# EAGLE design 3DR-GPS-LEA6-JST-v11-RELEASE (EAGLE 6.2)
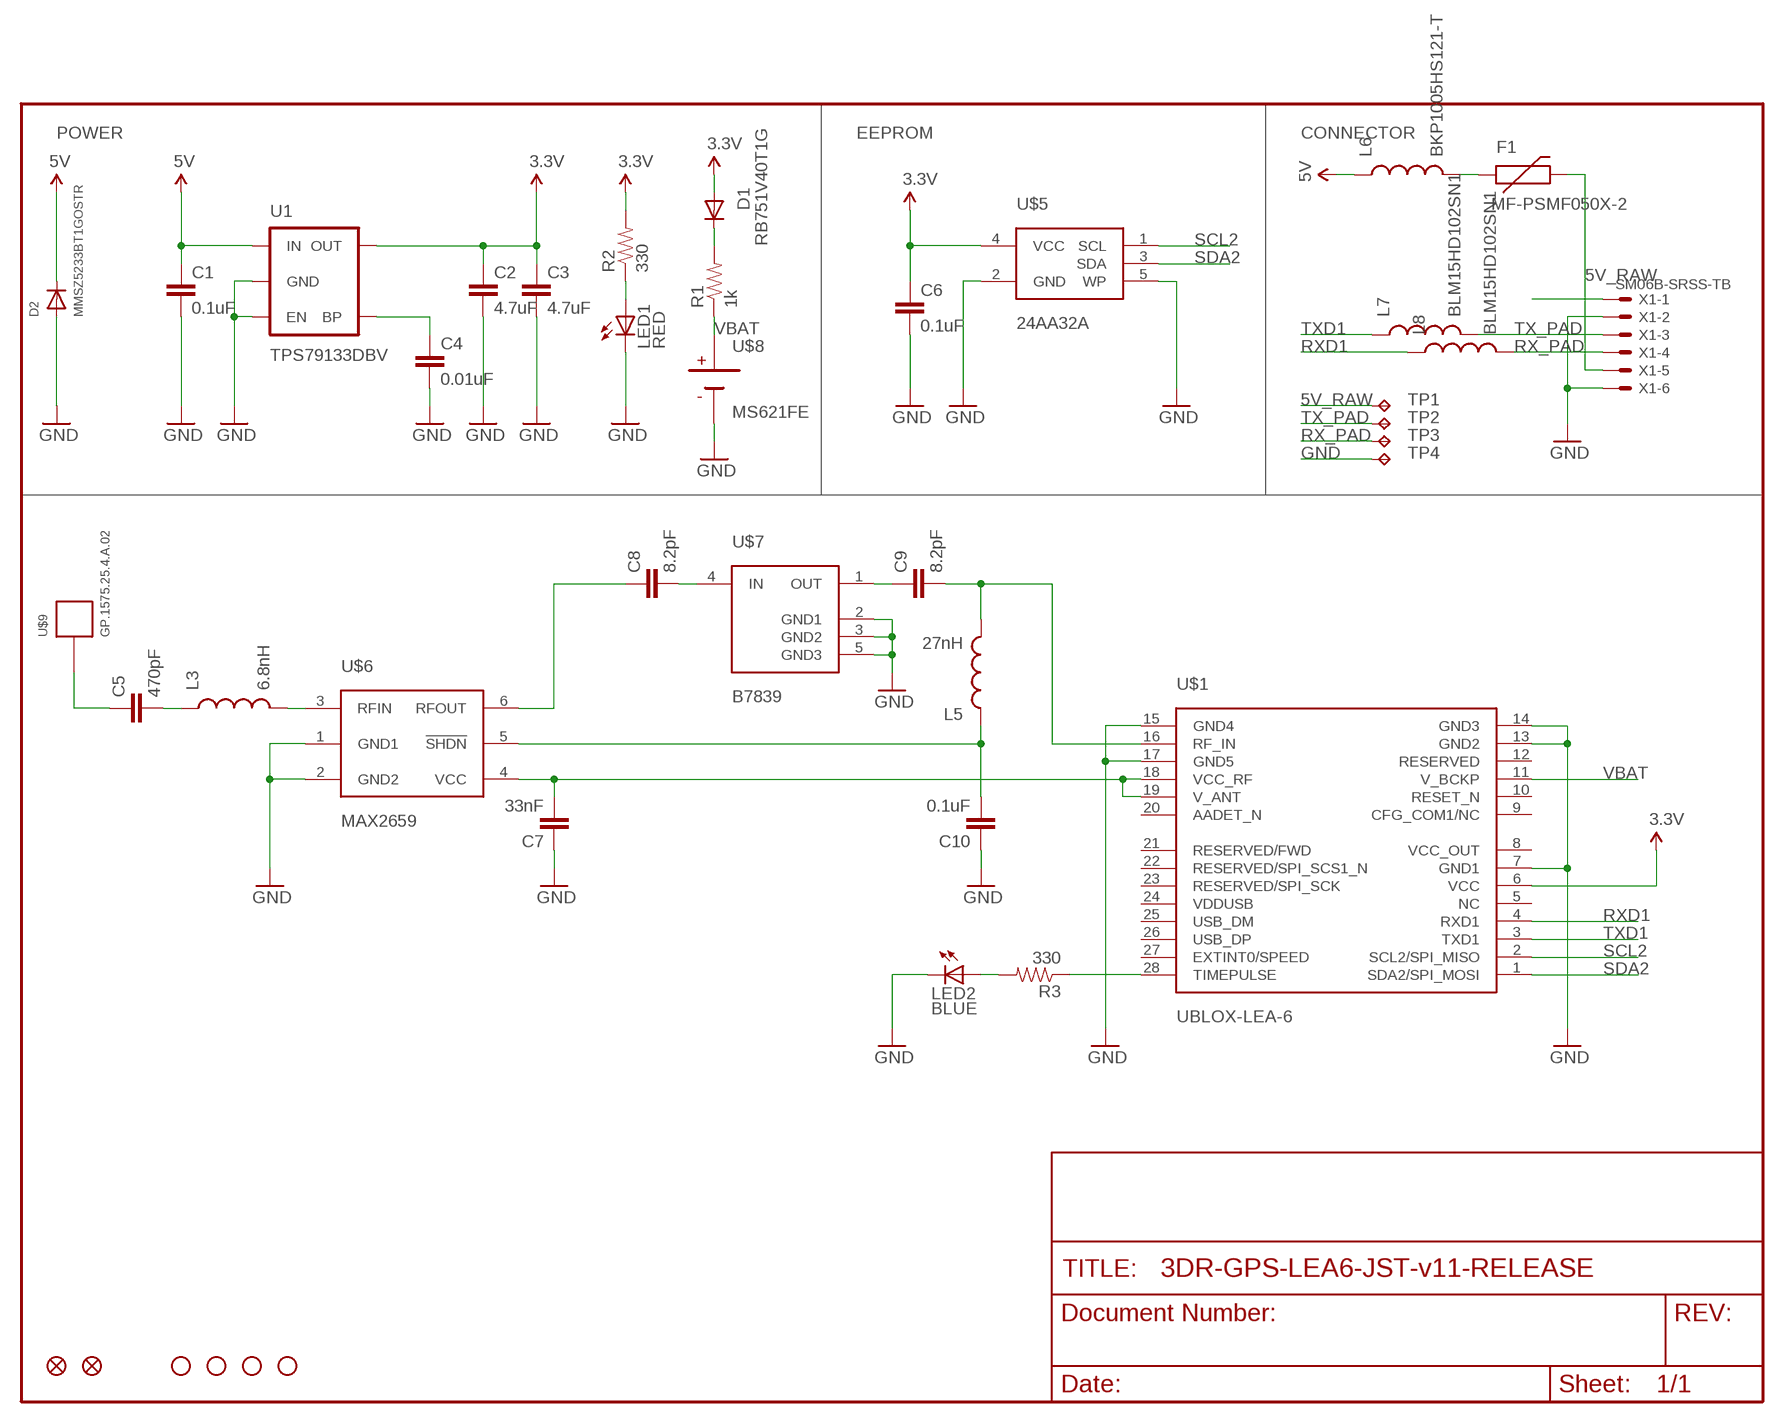
[diagram p0: schematic, sheet 1]

## Parts
C1  0.1uF  CAP0402-CAP  [0402-CAP]
C2  4.7uF  CAP0805  [0805]
C3  4.7uF  CAP0805  [0805]
C4  0.01uF  CAP0402-CAP  [0402-CAP]
C5  470pF  CAP0402-CAP  [0402-CAP]
C6  0.1uF  CAP0402-CAP  [0402-CAP]
C7  33nF  CAP0402-CAP  [0402-CAP]
C8  8.2pF  CAP0402-CAP  [0402-CAP]
C9  8.2pF  CAP0402-CAP  [0402-CAP]
C10  0.1uF  CAP0402-CAP  [0402-CAP]
D1  RB751V40T1G  DIODESOD  [SOD-323]
D2  MMSZ5233BT1GOSTR  DIODESOD-123  [SOD-123]
F1  MF-PSMF050X-2  PTC  [0805]
JP1  FIDUCIAL1X2  [FIDUCIAL-1X2]
JP2  FIDUCIAL1X2  [FIDUCIAL-1X2]
JP3  STAND-OFF  [STAND-OFF]
JP4  STAND-OFF  [STAND-OFF]
JP5  STAND-OFF  [STAND-OFF]
JP6  STAND-OFF  [STAND-OFF]
L3  6.8nH  INDUCTOR0402  [C0402]
L5  27nH  INDUCTOR0402  [C0402]
L6  BKP1005HS121-T  INDUCTOR0402  [0402-IND]
L7  BLM15HD102SN1  INDUCTOR0402  [0402-IND]
L8  BLM15HD102SN1  INDUCTOR0402  [0402-IND]
LED1  RED  LED0603  [LED-0603]
LED2  BLUE  LED0603  [LED-0603]
R1  1k  RESISTOR0402-RES  [0402-RES]
R2  330  RESISTOR0402-RES  [0402-RES]
R3  330  RESISTOR0402-RES  [0402-RES]
TP1  TPTP20SQ  [TP20SQ]
TP2  TPTP20SQ  [TP20SQ]
TP3  TPTP20SQ  [TP20SQ]
TP4  TPTP20SQ  [TP20SQ]
U1  TPS79133DBV  V_REG_LDOSMD  [SOT23-5]
U$1  UBLOX-LEA-6  [UBLOX-LEA-6]
U$5  24AA32A  [SOT23-5]
U$6  MAX2659  [UDFN-6]
U$7  B7839  [QCS5E]
U$8  MS621FE  [MS621FE]
U$9  GP.1575.25.4.A.02  [GP.1575.25.4.A.02]
X1  SM06B-SRSS-TB  [SM06B-SRSS-TB]

## Nets
3.3V: C2.1 C3.1 C6.1 D1.2(A) R2.2 U1.5(OUT) U$1.6(VCC) U$5.4(VCC)
5V: C1.1 D2.C L6.1 U1.1(IN)
5V_RAW: F1.2 TP1.TP X1.5
GND: C1.2 C2.2 C3.2 C4.2 C6.2 C7.1 C10.1 D2.A LED1.C LED2.C TP4.TP U1.2(GND) U1.3(EN) U$1.7(GND1) U$1.13(GND2) U$1.14(GND3) U$1.15(GND4) U$1.17(GND5) U$5.2(GND) U$5.5(WP) U$6.1(GND1) U$6.2(GND2) U$7.2(GND1) U$7.3(GND2) U$7.5(GND3) U$8.2(NEG) X1.2 X1.6
N$1: L3.2 U$6.3(RFIN)
N$2: C4.1 U1.4(BP)
N$3: C5.2 L3.1
N$4: C8.2 U$7.4(IN)
N$5: R3.1 U$1.28(TIMEPULSE)
N$6: C9.1 U$7.1(OUT)
N$7: C7.2 U$1.18(VCC_RF) U$1.19(V_ANT) U$6.4(VCC)
N$8: C8.1 U$6.6(RFOUT)
N$9: C10.2 L5.1 U$6.5(!SHDN)
N$10: C5.1 U$9.1(PIN)
N$11: C9.2 L5.2 U$1.16(RF_IN)
N$12: D1.1(C) R1.2
N$13: LED1.A R2.1
N$14: X1.1
N$15: LED2.A R3.2
N$16: F1.1 L6.2
RX_PAD: L8.2 TP3.TP X1.4
RXD1: L8.1 U$1.4(RXD1)
SCL2: U$1.2(SCL2/SPI_MISO) U$5.1(SCL)
SDA2: U$1.1(SDA2/SPI_MOSI) U$5.3(SDA)
TX_PAD: L7.2 TP2.TP X1.3
TXD1: L7.1 U$1.3(TXD1)
VBAT: R1.1 U$1.11(V_BCKP) U$8.1(POS)
Unconnected: U$1.5(NC) U$1.8(VCC_OUT) U$1.9(CFG_COM1/NC) U$1.10(RESET_N) U$1.12(RESERVED) U$1.20(AADET_N) U$1.21(RESERVED/FWD) U$1.22(RESERVED/SPI_SCS1_N) U$1.23(RESERVED/SPI_SCK) U$1.24(VDDUSB) U$1.25(USB_DM) U$1.26(USB_DP) U$1.27(EXTINT0/SPEED)

## Notes on the sheet
- POWER | EEPROM | CONNECTOR

## Library data of the parts
C1-C10 = SparkFun:CAP: Capacitor Standard 0603 ceramic capacitor, and 0.1" leaded capacitor.
D1 = SparkFun:DIODE: Diode
D2 = adafruit:DIODE: Diode
F1 = 3DRobotics:PTC: Resettable Fuse PTC Resettable Fuse. Spark Fun Electronics SKU : COM-08357; DATASHEET: http://www.bourns.com/data/global/PDFs/mfpsmf.pdf; LINK: http://parts.digikey.com/1/parts/1323493-fuse-ptc-resettable-smd-0805-mf-psmf050x-2.html; MFGPN: MF-PSMF050X-2
JP1 JP2 = SparkFun:FIDUCIAL: Fiducial Alignment Points Various fiducial points for machine vision alignment.
JP3-JP6 = SparkFun:STAND-OFF: Stand Off This is the mechanical footprint for a #4 phillips button head screw. Use the keepout ring to avoid running the screw head into surrounding components. SKU : PRT-00447
L3 L5 = SparkFun:INDUCTOR: Inductors Basic Inductor/Choke - 0603 and 1206. Footprints are not proven and vary greatly between part numbers.
L6-L8 = pixhawk2:INDUCTOR: Inductors Basic Inductor/Choke - 0603 and 1206. Footprints are not proven and vary greatly between part numbers.
LED1 LED2 = SparkFun:LED: LEDs Standard schematic elements and footprints for 5mm, 3mm, 1206, and 0603 sized LEDs. 5mm - Spark Fun Electronics SKU : COM-00529 (and others)
R1-R3 = SparkFun:RESISTOR: Resistor Basic schematic elements and footprints for 0603, 1206, and PTH resistors.
TP1-TP4 = testpad:TP: Test pad
U1 = SparkFun:V_REG_LDO: Voltage Regulator LDO Standard 150mA LDO voltage regulator in SOT-23 layout. Micrel part MIC5205. BP (by-pass) pin is used to lower output noise with 470pF cap.
U$1 = 3DRobotics:UBLOX-LEA-6: u-blox LEA-6 GPS Module The LEA-6 module series is a family of stand-alone GPS receivers featuring the high performance u-blox 6 positioning engine. These versatile receivers feature an extensive and flexible range of functionality, connectivity and cost savings options. LEA-6 modules maintain the industry standard 17.0 x 22.4mm form factor of the LEA-5 series and have been designed to allow simple migration. Their ease of integration results in reduced costs and short time to market for a wide range of automotive, consumer and industrial applications. The 50-channel u-blox 6 positioning engine boasts a Time-To-First-Fix (TTFF) of under 1 second. The dedicated acquisition engine, with over 2 million correlators, is capable of massive parallel time/frequency space searches, enabling it to find satellites instantly. Innovative design and technology suppresses interference sources and mitigates multipath effects, giving LEA-6 GPS receivers excellent navigation performance even in the most challenging environments.; DATASHEET: http://www.u-blox.com/images/downloads/Product_Docs/LEA-6_DataSheet_%28GPS.G6-HW-09004%29.pdf; LINK: http://www.u-blox.com/en/gps-modules/pvt-modules/lea-6-family.html; MFGPN: LEA-6
U$5 = 3DRobotics:24AA32A: Microchip 24AA32A 32K I2C EEPROM The Microchip Technology Inc. 24AA32A/24LC32A (24XX32A*) is a 32 Kbit Electrically Erasable PROM. The device is organized as a single block of 4K x 8-bit memory with a 2-wire serial interface. Low-voltage design permits operation down to 1.7V, with standby and active currents of only 1 ?A and 1 mA, respectively. It has been developed for advanced, lowpower applications such as personal communications or data acquisition. The 24XX32A also has a page write capability for up to 32 bytes of data. Functional address lines allow up to eight devices on the same bus, for up to 256 Kbits address space. The 24XX32A is available in the standard 8-pin PDIP, surface mount SOIC, SOIJ, TSSOP, DFN, TDFN and MSOP packages. The 24XX32A is also available in the 5-lead SOT-23 and Chip Scale packages.; DATASHEET: http://ww1.microchip.com/downloads/en/DeviceDoc/21713L.pdf; LINK: http://www.microchip.com/wwwproducts/Devices.aspx?dDocName=en010787; MFGPN: 24AA32A
U$6 = 3DRobotics:MAX2659: MAX2659 GPS/GNSS Low-Noise Amplifier The MAX2659 high-gain, low-noise amplifier (LNA) is designed for GPS, Galileo, and GLONASS applications. Designed in Maxim?s advanced SiGe process, the device achieves a 20.5dB gain and an ultra-low-noise figure of 0.8dB while maximizing the input-referred 1dB compression point and the 3rd-order intercept point at -12dBm and -5dBm, respectively. The MAX2659 operates from a +1.6V to +3.6V single supply and consumes only 4.1mA. The shutdown feature in the device reduces the supply current to be less than 1?A. The MAX2659 is available in a very small, lead-free, RoHS-compliant, 1.5mm x 1.0mm x 0.75mm, 6-pin ?DFN package. High-Power Gain: 20.5dB Ultra-Low-Noise Figure: 0.8dB Integrated 50? Output Matching Circuit Low Supply Current: 4.1mA Wide Supply Voltage Range: 1.6V to 3.6V Low Bill of Materials Small Footprint: 1.5mm x 1.0mm Thin Profile: 0.75mm Lead-Free and RoHS-Compliant Package; DATASHEET: http://datasheets.maxim-ic.com/en/ds/MAX2659.pdf; LINK: http://www.maxim-ic.com/datasheet/index.mvp/id/5299; MFGPN: MAX2659
U$7 = 3DRobotics:B7839: EPCOS B7839 SAW Rx Filter; DATASHEET: http://www.epcos.com/inf/40/ds/mc/B7839.pdf; MFGPN: B7839
U$8 = 3DRobotics:MS621FE: SEIKO 6.8mm Rechargeable 3V lithium battery If discontinued or not available, similar devices are available from Panasonic and Sanyo, usually direct replacements.; DATASHEET: http://speed.sii.co.jp/data/file_PRODUCT_MASTER_50112_TITLE_IMAGESP.pdf; LINK: http://search.digikey.com/us/en/products/MS621FE-FL11E/728-1057-ND/1889208; MFGPN: MS621FE
U$9 = 3DRobotics:GP.1575.25.4.A.02: Taoglas GP.1575.25.4.A.02 4mm thick GPS Patch Antenna, 1575MHz 25mm*25mm*4mm; DATASHEET: http://www.taoglas.com/images/product_images/original_images/GP.1575.25.4.A.02%20GPS%20Patch%20Antenna%201575MHz%20190410.pdf; LINK: http://www.taoglas.com/antennas/GPS-GLONASS_Antennas/Internal_GPS_-_Passive_Ceramic_Patch_Antennas/; MFGPN: GP.1575.25.4.A.02
X1 = con-jst2:?M06B-SRSS-TB: Disconnectable Crimp style connector, 1.0mm pitch 6 contacts

## Board
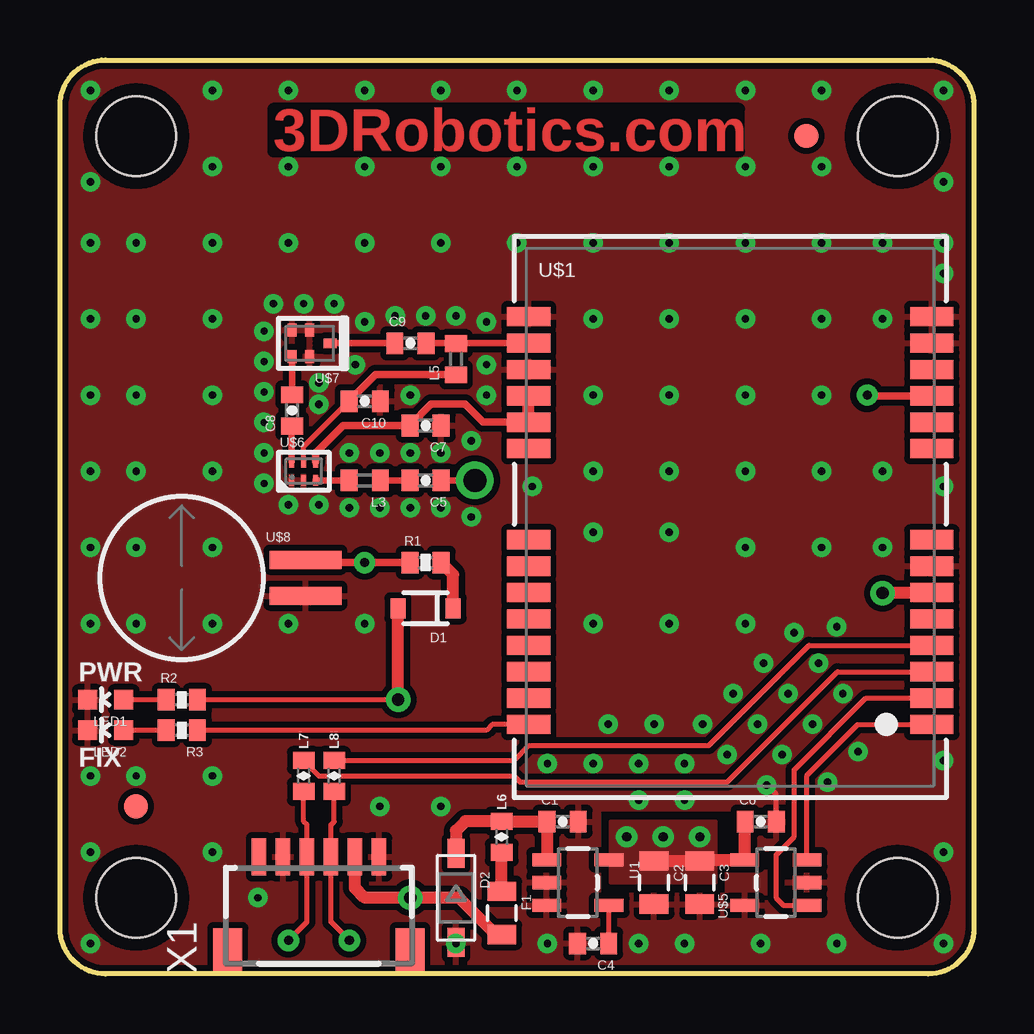
[diagram p1: board, top side]
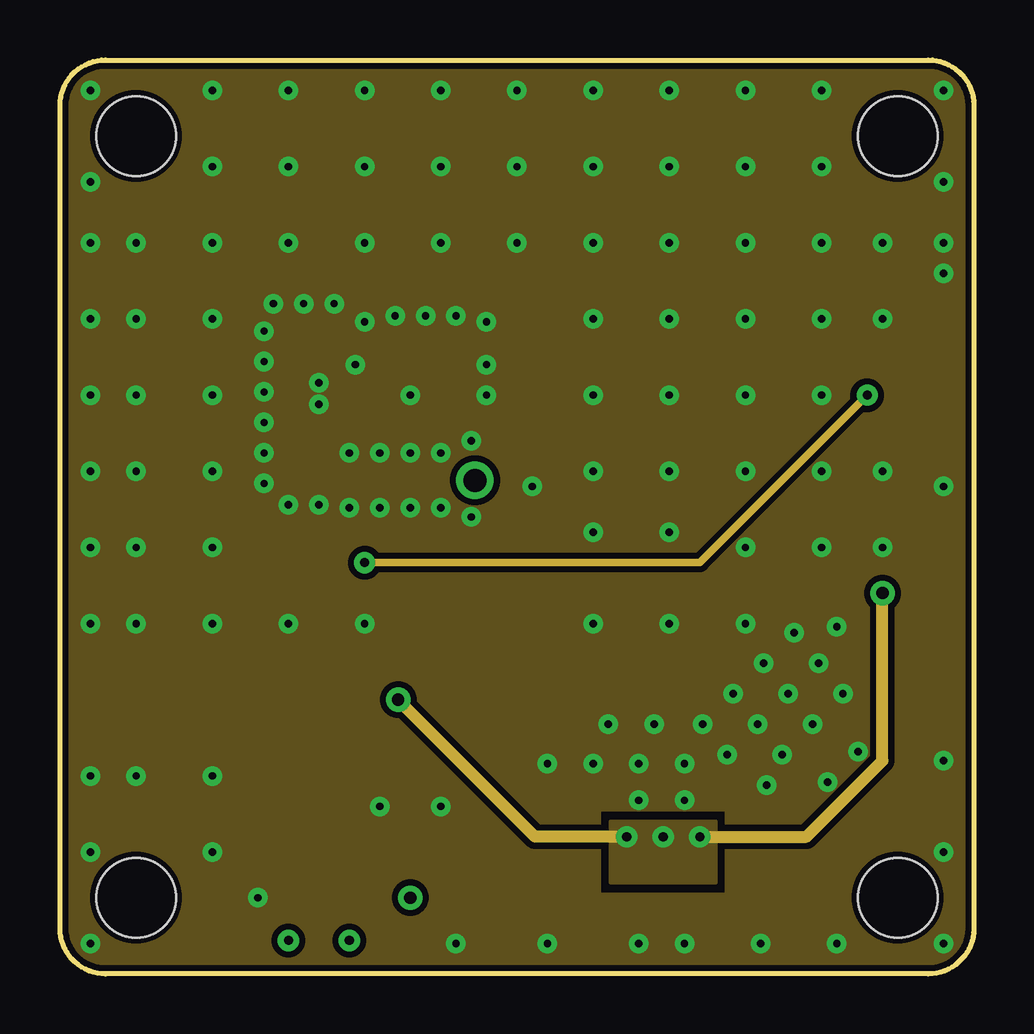
[diagram p2: board, inner layer Route2]
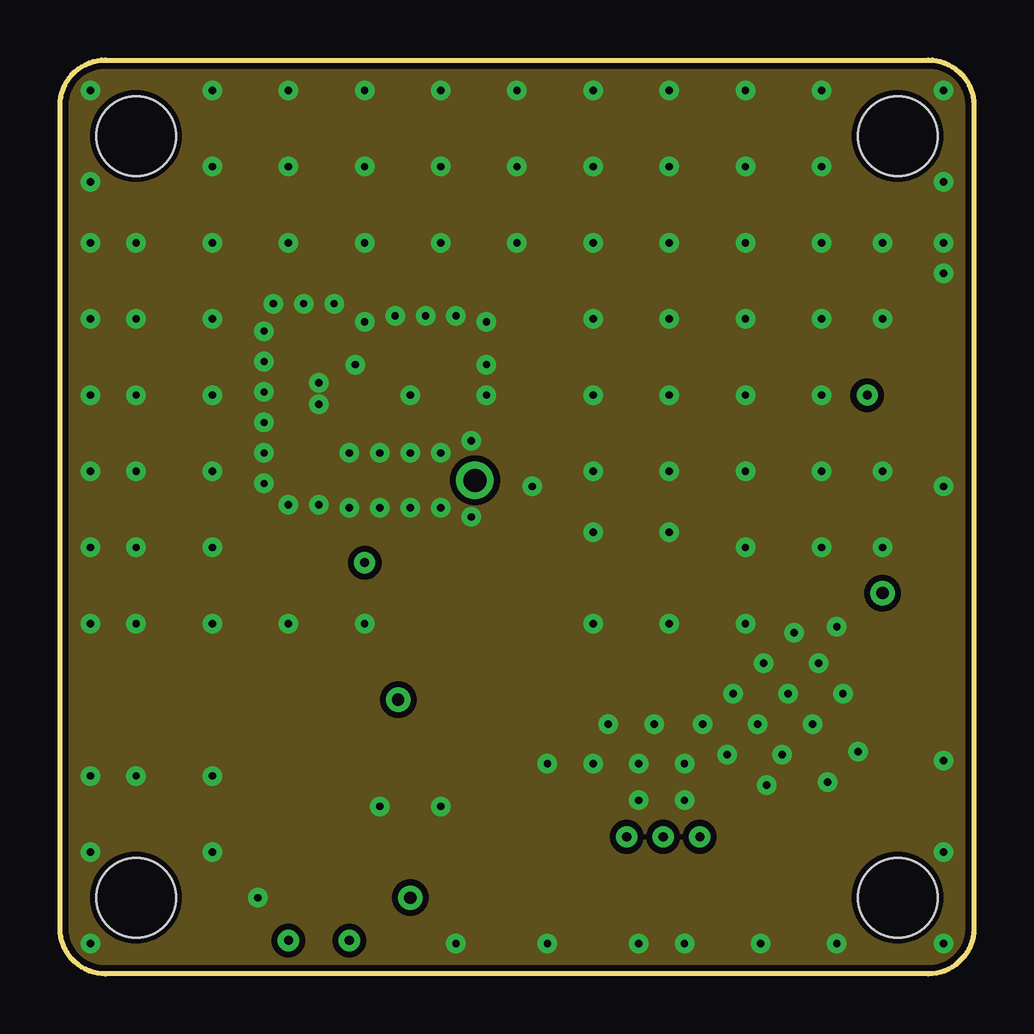
[diagram p3: board, inner layer Route15]
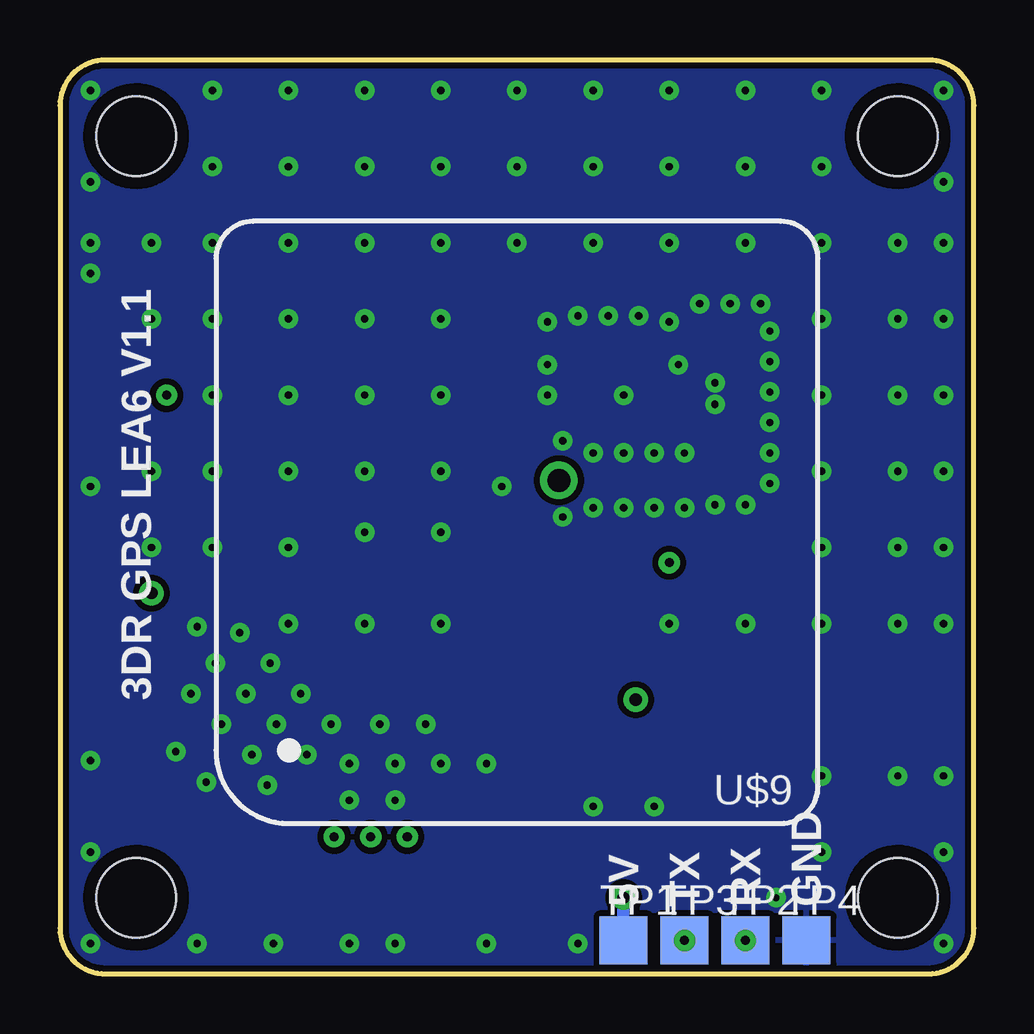
[diagram p4: board, bottom side, seen from below]

Size 38.1 x 38.1 mm. Coordinates in mm from the lower left corner, seen from the top.
Outline: 1.91,0 arc-90 0,1.91 0,36.2 arc-90 1.91,38.1 36.2,38.1 arc-90 38.1,36.2 38.1,1.91 arc-90 36.2,0 1.91,0
Copper layers (1*2*15*16): Top 0.035mm / dielectric 0.5mm / Route2 0.035mm / dielectric 0.5mm / Route15 0.035mm / dielectric 0.5mm / Bottom 0.035mm
Design rules: minimum track width 7mil, minimum drill 10mil, track to track 7mil, track to pad 7mil, pad to pad 7mil, via to via 7mil, smd to smd 0mil, copper to edge 10mil, drill to drill 8mil, minimum pad ring 12mil, minimum via ring 10mil, stop-mask expansion 4mil, vias tented up to drill 25mil, thermal gap 10mil

### Footprints (pad centres in the part's own frame; a part is rotated, then mirrored left to right if it is on the bottom)
0402-CAP = smd 0.7 x 0.9: 1 -0.65,0; 2 0.65,0
0805 = smd 0.8 x 1.2: 1 -0.9,0; 2 0.9,0
SOD-323 = smd 0.63 x 0.83: 1 -1.15,0; 2 1.15,0
SOD-123 = smd 1.2 x 0.7: A 1.85,0; C -1.85,0
FIDUCIAL-1X2 = smd 1 x 1: 1 0,0
STAND-OFF = hole 3.302: 0,0
C0402 = smd 0.7 x 0.9: 1 -0.65,0; 2 0.65,0
0402-IND = smd 0.7 x 0.9: 1 -0.65,0; 2 0.65,0
LED-0603 = smd 0.8 x 0.8: A 0,-0.75; C 0,0.75
0402-RES = smd 0.7 x 0.9: 1 -0.65,0; 2 0.65,0
TP20SQ = smd 2 x 2: TP 0,0
SOT23-5 = smd 0.55 x 1.2: 1 -0.95,-1.3; 2 0,-1.3; 3 0.95,-1.3; 4 0.95,1.3; 5 -0.95,1.3
UBLOX-LEA-6 = smd 1.8 x 0.8: 1 8.4,-8.65; 2 8.4,-7.55; 3 8.4,-6.45; 4 8.4,-5.35; 5 8.4,-4.25; 6 8.4,-3.15; 7 8.4,-2.05; 8 8.4,-0.95; 9 8.4,2.85; 10 8.4,3.95; 11 8.4,5.05; 12 8.4,6.15; 13 8.4,7.25; 14 8.4,8.35; 15 -8.4,8.35; 16 -8.4,7.25; 17 -8.4,6.15; 18 -8.4,5.05; 19 -8.4,3.95; 20 -8.4,2.85; 21 -8.4,-0.95; 22 -8.4,-2.05; 23 -8.4,-3.15; 24 -8.4,-4.25; 25 -8.4,-5.35; 26 -8.4,-6.45; 27 -8.4,-7.55; 28 -8.4,-8.65
UDFN-6 = smd 0.2 x 0.45: 1 -0.5,-0.375; 2 0,-0.375; 3 0.5,-0.375; 4 0.5,0.375; 5 0,0.375; 6 -0.5,0.375
QCS5E = smd 0.55 x 0.38: 1 -0.85,0 | smd 0.38 x 0.55: 2 0,-0.55; 3 0.735,-0.55; 4 0.735,0.55; 5 0,0.55
MS621FE = smd 3 x 0.75: 1 5.15,0.75; 2 5.15,-0.75
GP.1575.25.4.A.02 = drill 0.95: 1 -1.75,-1.75
SM06B-SRSS-TB = smd 0.6 x 1.55: 1 -2.5,2.975; 2 -1.5,2.975; 3 -0.5,2.975; 4 0.5,2.975; 5 1.5,2.975; 6 2.5,2.975 | smd 1.2 x 1.8: FIT@1 -3.8,-0.9; FIT@2 3.8,-0.9

### Placement (x,y rotation side)
C1  20.95,6.35 0 top
C2  24.77,3.81 270 top
C3  26.67,3.81 270 top
C4  22.23,1.27 180 top
C5  15.24,20.57 180 top
C6  29.21,6.35 0 top
C7  15.24,22.86 180 top
C8  9.68,23.5 90 top
C9  14.61,26.29 0 top
C10  12.7,23.88 180 top
D1  15.24,15.24 180 top
D2  16.51,3.17 270 top
F1  18.41,2.54 270 top
JP1  31.11,34.92 0 top
JP2  3.17,6.99 0 top
JP3  3.17,3.17 0 top
JP4  3.17,34.92 0 top
JP5  34.92,34.92 0 top
JP6  34.92,3.17 0 top
L3  12.7,20.57 180 top
L5  16.51,25.63 90 top
L6  18.41,5.71 270 top
L7  10.16,8.26 270 top
L8  11.43,8.26 270 top
LED1  1.91,11.43 90 top
LED2  1.91,10.16 90 top
R1  15.24,17.14 0 top
R2  5.08,11.43 0 top
R3  5.08,10.16 180 top
TP1  14.61,1.4 0 bottom
TP2  9.53,1.4 0 bottom
TP3  12.06,1.4 0 bottom
TP4  6.99,1.4 0 bottom
U1  21.59,3.81 270 top
U$1  27.94,19.05 0 top
U$5  29.84,3.81 90 top
U$6  10.16,20.95 0 top
U$7  10.41,26.29 180 top
U$8  5.08,16.51 0 top
U$9  19.05,18.82 180 bottom
X1  10.79,1.91 0 top

### Tracks (layer width: path | path; a pad name or v marks a point on that pad's centre or on a via)
3.3V  (via drill 0.38, 0.51)
  Top 0.203: v14.1,11.43 R2.2
  Top 0.508: 24.71,4.76 C2.1 C3.1 26.72,4.76 U$5.4 28.56,4.78 C6.1 | U$1.6 34.31,15.9 v34.29,15.88 | v14.1,11.43 D1.2
  Route2 0.508: v34.29,15.88 34.29,8.89 31.11,5.71 v26.67,5.71 | v23.62,5.71 19.81,5.71 v14.1,11.43
  other vias: 25.15,5.71
  pour Top (isolate 0.254, no thermals): 22.99,3.81 22.99,6.35 27.3,6.35 27.3,3.81
  pour Route2 (isolate 0.254): 22.99,3.81 22.99,6.35 27.3,6.35 27.3,3.81
5V
  Top 0.508: U1.1 20.3,4.78 C1.1 18.43,6.35 L6.1 16.91,6.37 16.51,5.97 D2.C
5V_RAW  (via drill 0.51)
  Top 0.508: X1.5 12.29,3.58 12.7,3.17 v14.61,3.17 16.64,3.17 18.17,1.64 F1.2
  Bottom 0.508: TP1.TP v14.61,3.17
GND  (via drill 0.3)
  Top 0.203: C6.2 29.86,7.48 v29.46,7.87
  other vias: 20.32,1.27 26.04,1.27 32.38,1.27 29.21,1.27 33.27,9.27 1.27,8.26 36.83,5.08 36.83,8.89 12.7,14.61 3.17,14.61 1.27,20.95 9.53,14.61 1.27,24.13 1.27,27.3 3.17,30.48 1.27,33.02 6.35,33.66 6.35,36.83 9.53,36.83 12.7,36.83 15.88,36.83 19.05,36.83 22.23,36.83 25.4,36.83 28.57,36.83 36.83,33.02 36.83,29.21 36.83,20.32 20.32,8.76 22.23,8.76 24.13,8.76 26.04,8.76 27.81,9.14 29.08,10.41 31.62,12.95 30.35,11.68 32.64,11.68 31.37,10.41 30.1,9.14 26.04,7.24 24.13,7.24 13.34,6.99 1.27,36.83 36.83,36.83 36.83,1.27 1.27,1.27 15.88,6.99 16.51,1.27 32,8 22.86,10.41 24.77,10.41 26.8,10.41 28.07,11.68 29.34,12.95 30.61,14.22 32.38,14.48 17.78,25.4 17.78,24.13 17.78,27.18 16.51,27.43 15.24,27.43 13.97,27.43 12.7,27.18 11.43,27.94 10.16,27.94 8.89,27.94 8.51,26.8 8.51,25.53 8.51,24.26 10.79,23.75 8.51,22.99 8.51,21.72 10.79,24.64 8.51,20.45 9.53,19.56 10.79,19.56 12.06,19.43 13.34,19.43 14.61,19.43 15.88,19.43 14.61,21.72 15.88,21.72 31.75,36.83 6.35,30.48 9.53,33.66 12.7,33.66 15.88,33.66 19.05,33.66 22.23,33.66 25.4,33.66 28.57,33.66 31.75,33.66 9.53,30.48 12.7,30.48 15.88,30.48 19.05,30.48 22.23,30.48 25.4,30.48 28.57,30.48 31.75,30.48 36.83,30.48 1.27,30.48 1.27,5.08 3.17,27.3 3.17,24.13 1.27,17.78 3.17,17.78 3.17,8.26 24.13,1.27 34.29,30.48 34.29,27.3 31.75,27.3 28.57,27.3 25.4,27.3 22.23,27.3 22.23,24.13 25.4,24.13 28.57,24.13 31.75,24.13 34.29,20.95 31.75,20.95 28.57,20.95 25.4,20.95 22.23,20.95 34.29,17.78 31.75,17.78 28.57,17.78 25.4,18.41 22.23,18.41 28.57,14.61 25.4,14.61 1.27,14.61 3.17,20.95 6.35,8.26 12.32,25.4 6.35,14.61 6.35,20.95 6.35,17.78 6.35,27.3 6.35,24.13 13.34,21.72 12.06,21.72 14.61,24.13 17.14,22.23 17.14,19.05 19.68,20.32 8.26,3.17 22.23,14.61 6.35,5.08
  pour Route15 (isolate 0.254): 0,0 0,41.91 38.1,41.91 38.1,0
  pour Top (isolate 0.254): 22.23,0 22.23,3.3 27.81,3.3 27.81,6.99 39.37,6.99 39.37,0
  pour Top (isolate 0.254): 22.48,0 22.48,39.37 0,39.37 0,0
  pour Bottom (isolate 0.254): 0,0 0,39.37 0,43.18 38.1,43.18 38.1,0
  pour Route2 (isolate 0.254): 0,0 22.48,0 22.48,40.64 0,40.64
  pour Top (isolate 0.254): 39.37,6.86 22.23,6.86 22.23,39.37 39.37,39.37
  pour Route2 (isolate 0.254): 22.48,0 22.48,3.3 27.81,3.3 27.81,6.86 22.48,6.86 22.48,40.64 38.1,40.64 38.1,0
N$1
  Top 0.265: L3.2 U$6.3
N$2
  Top 0.203: U1.4 22.89,1.28 C4.1
N$3
  Top 0.265: L3.1 C5.2
N$4
  Top 0.265: U$7.4 C8.2
N$5
  Top 0.203: R3.1 17.78,10.16 18.02,10.4 U$1.28
N$6
  Top 0.265: U$7.1 C9.1
N$7
  Top 0.305: U$1.19 17.64,23 16.89,23.75 15.48,23.75 C7.2 11.81,22.86 10.66,21.71 U$6.4
  Top 0.508: U$1.19 U$1.18
N$8
  Top 0.265: U$6.6 9.66,22.83 C8.1
N$9
  Top 0.203: U$6.5 10.16,21.99 C10.2
  Top 0.305: L5.1 13.15,24.98 C10.2
N$10
  Top 0.265: C5.1 U$9.1
N$11
  Top 0.265: C9.2 16.35,26.29 L5.2 16.68,26.3 U$1.16
N$12
  Top 0.508: 15.88,17.13 R1.2 16.39,16.64 D1.1
N$13
  Top 0.203: R2.1 LED1.A
N$15
  Top 0.203: R3.2 LED2.A
N$16
  Top 0.508: F1.1 L6.2
RX_PAD  (via drill 0.38)
  Top 0.203: TP3.TP 11.29,2.17 X1.4 11.29,6.21 11.43,6.35 L8.2
  other vias: 12.06,1.4
RXD1
  Top 0.203: U$1.4 31.23,13.7 27.05,9.53 19.56,9.53 18.94,8.9 L8.1
SCL2
  Top 0.203: U$1.2 33.6,11.5 30.61,8.51 30.61,5.71 29.84,4.95 29.84,3.17 30.16,2.86 U$5.1
SDA2
  Top 0.203: U$1.1 33.26,10.4 31.14,8.29 U$5.3
TX_PAD  (via drill 0.38)
  Top 0.203: TP2.TP 10.29,2.17 X1.3 10.29,6.21 10.16,6.35 L7.2
  other vias: 9.53,1.4
TXD1
  Top 0.203: U$1.3 32.41,12.6 27.81,8 19.18,8 18.92,8.26 10.79,8.26 10.16,8.89 L7.1
VBAT  (via drill 0.38)
  Top 0.305: U$1.11 33.69,24.1 v33.66,24.13 | R1.1 v12.7,17.14 10.35,17.14 U$8.1
  Route2 0.305: v12.7,17.14 26.67,17.14 v33.66,24.13

### Text on the board
Top: 3DRobotics.com
tPlace: PWR | FIX
bPlace: 3DR GPS LEA6 V1.1 | GND | RX | TX | 5V
tStop: 3DRobotics.com